# EAGLE schematic headstage_isolation_board_01 (EAGLE 7.5.0)
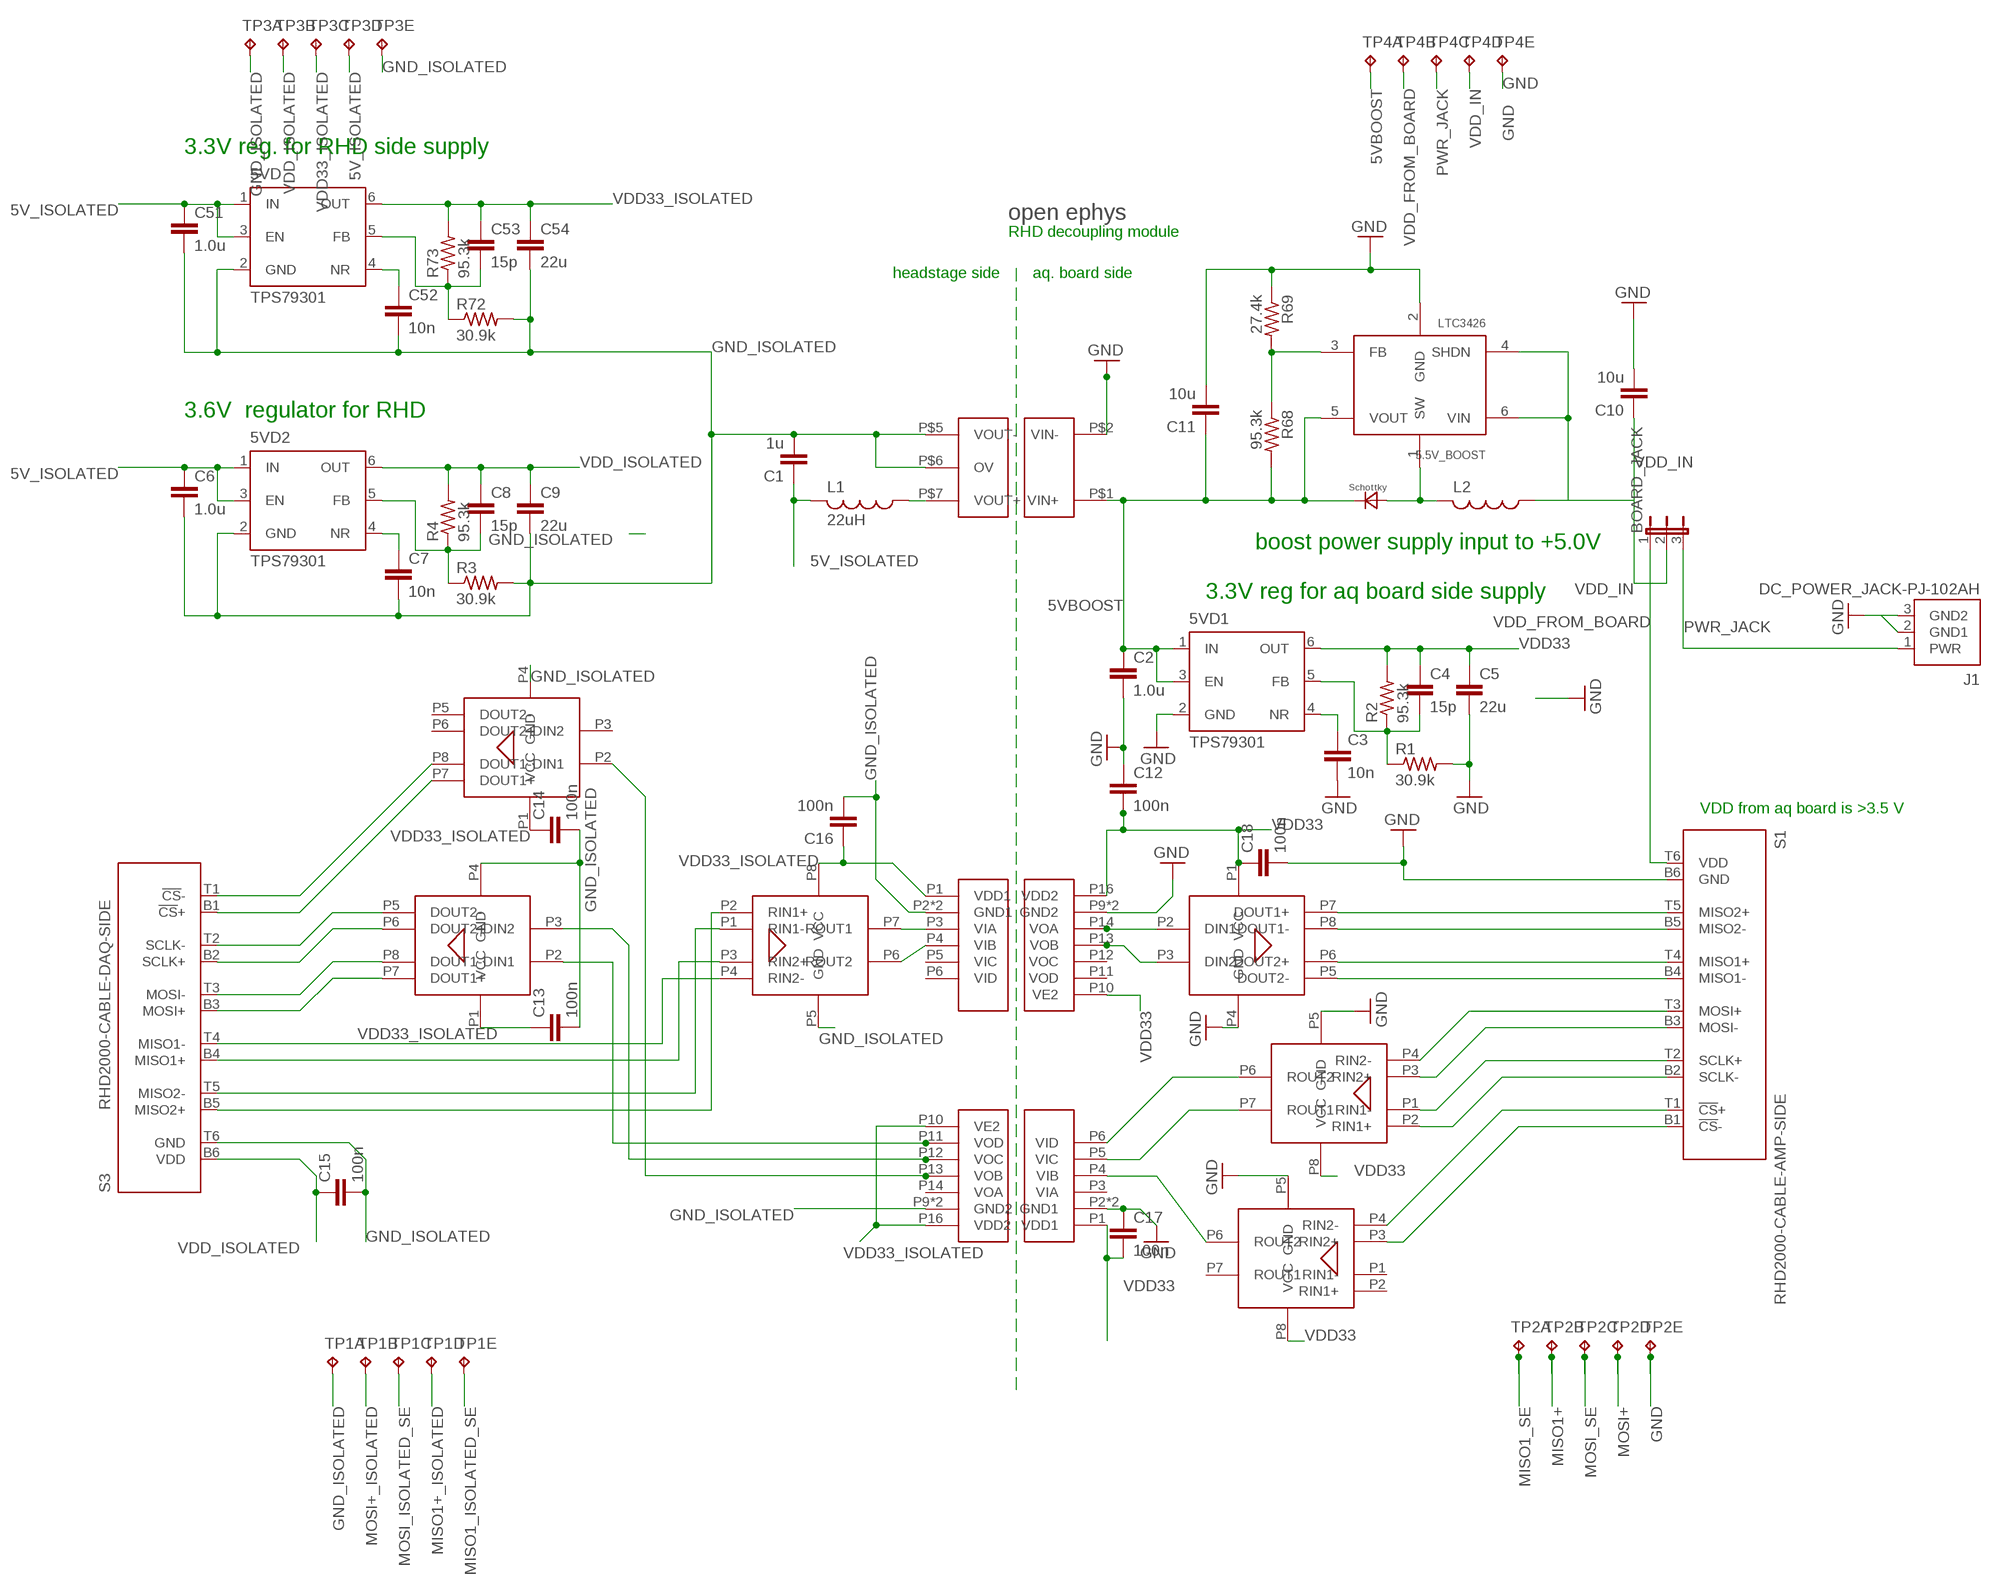
[diagram p0: schematic, sheet 1]

## Parts
5.5V_BOOST  LTC3426  [SOT23-6]
5VD  TPS79301  [SOT-23-6]
5VD1  TPS79301  [SOT-23-6]
5VD2  TPS79301  [SOT-23-6]
BOARD_JACK  JP2E  [JP2]
C1  1u  C_1206  [1206]
C2  1.0u  C_0805  [0805]
C3  10n  C_0603  [0603]
C4  15p  C_0603  [0603]
C5  22u  C_1206  [1206]
C6  1.0u  C_0805  [0805]
C7  10n  C_0603  [0603]
C8  15p  C_0603  [0603]
C9  22u  C_1206  [1206]
C10  10u  C_1206  [1206]
C11  10u  C_1206  [1206]
C12  100n  C_0603  [0603]
C13  100n  C_0603  [0603]
C14  100n  C_0603  [0603]
C15  100n  C_0603  [0603]
C16  100n  C_0603  [0603]
C17  100n  C_0603  [0603]
C18  100n  C_0603  [0603]
C51  1.0u  C_0805  [0805]
C52  10n  C_0603  [0603]
C53  15p  C_0603  [0603]
C54  22u  C_1206  [1206]
D1  MBRA210LT3-D  [MBRA210LT3-D]
J1  DC_POWER_JACK-PJ-102AH  [PJ-102AH]
L1  22uH  L_1206  [1206]
L2  L_1206  [1206]
R1  30.9k  R_0603  [0603]
R2  95.3k  R_0603  [0603]
R3  30.9k  R_0603  [0603]
R4  95.3k  R_0603  [0603]
R68  95.3k  R_0603  [0603]
R69  27.4k  R_0603  [0603]
R72  30.9k  R_0603  [0603]
R73  95.3k  R_0603  [0603]
S1  RHD2000-CABLE-AMP-SIDE  [OMNETICS_PZN-12-AA]
S3  RHD2000-CABLE-DAQ-SIDE  [OMNETICS_PZN-12-AA]
TP1  TP5P5-25-13  [P5-25-13]
TP2  TP5P5-25-13  [P5-25-13]
TP3  TP5P5-25-13  [P5-25-13]
TP4  TP5P5-25-13  [P5-25-13]
U$1  OPEN_EPHYS_LOGO  [OPEN_EPHYS_LOGO]
U$2  ADUM3440  [SOIC_WIDE_16]
U$4  ADN4663  [8-SOIC]
U$5  ADN4663  [8-SOIC]
U$6  ADN4664  [8-SOIC]
U$7  ADN4664  [8-SOIC]
U$8  ADN4664  [8-SOIC]
U$9  ADN4663  [8-SOIC]
U$10  ADUM3440  [SOIC_WIDE_16]
U$12  NMV0505  [NMV0505]

## Nets
5V_ISOLATED: 5VD2.1(IN) 5VD2.3(EN) 5VD.1(IN) 5VD.3(EN) C1.1 C6.1 C51.1 L1.2 TP3.TP-4
5VBOOST: 5.5V_BOOST.5(VOUT) 5VD1.1(IN) 5VD1.3(EN) C2.1 C11.1 D1.NEG R68.2 TP4.TP-1 U$12.P$1(VIN+)
CS+: S1.T1(!CS!+) U$8.P4(RIN2-)
CS+_ISOLATED: S3.B1(!CS!+) U$9.P7(DOUT1+)
CS-: S1.B1(!CS!-) U$8.P3(RIN2+)
CS-_ISOLATED: S3.T1(!CS!-) U$9.P8(DOUT1-)
CS_ISOLATED_SE: U$2.P13(VOB) U$9.P2(DIN1)
CS_SE: U$2.P4(VIB) U$8.P6(ROUT2)
GND: 5.5V_BOOST.2(GND) 5VD1.2(GND) C2.2 C3.2 C5.2 C10.2 C11.2 C12.1 C17.1 C18.2 J1.2(GND1) J1.3(GND2) R1.2 R69.1 S1.B6(GND) TP2.TP-5 TP4.TP-5 U$2.P2(GND1) U$2.P8(GND1) U$4.P4(GND) U$7.P5(GND) U$8.P5(GND) U$10.P9(GND2) U$10.P15(GND2) U$12.P$2(VIN-)
GND4: C15.2
GND_ISOLATED: 5VD2.2(GND) 5VD.2(GND) C1.2 C6.2 C7.2 C9.2 C13.2 C14.2 C16.2 C51.2 C52.2 C54.2 R3.2 R72.2 S3.T6(GND) TP1.TP-1 TP3.TP-1 TP3.TP-5 U$2.P9(GND2) U$2.P15(GND2) U$5.P4(GND) U$6.P5(GND) U$9.P4(GND) U$10.P2(GND1) U$10.P8(GND1) U$12.P$5(VOUT-) U$12.P$6(OV)
MISO1+: S1.T4(MISO1+) TP2.TP-2 U$4.P6(DOUT2+)
MISO1+_ISOLATED: S3.B4(MISO1+) TP1.TP-4 U$6.P3(RIN2+)
MISO1-: S1.B4(MISO1-) U$4.P5(DOUT2-)
MISO1-_ISOLATED: S3.T4(MISO1-) U$6.P4(RIN2-)
MISO1_ISOLATED_SE: TP1.TP-5 U$6.P6(ROUT2) U$10.P4(VIB)
MISO1_SE: TP2.TP-1 U$4.P3(DIN2) U$10.P13(VOB)
MISO2+: S1.T5(MISO2+) U$4.P7(DOUT1+)
MISO2+_ISOLATED: S3.B5(MISO2+) U$6.P2(RIN1+)
MISO2-: S1.B5(MISO2-) U$4.P8(DOUT1-)
MISO2-_ISOLATED: S3.T5(MISO2-) U$6.P1(RIN1-)
MISO2_ISOLATED_SE: U$6.P7(ROUT1) U$10.P3(VIA)
MISO2_SE: U$4.P2(DIN1) U$10.P14(VOA)
MOSI+: S1.T3(MOSI+) TP2.TP-4 U$7.P4(RIN2-)
MOSI+_ISOLATED: S3.B3(MOSI+) TP1.TP-2 U$5.P7(DOUT1+)
MOSI-: S1.B3(MOSI-) U$7.P3(RIN2+)
MOSI-_ISOLATED: S3.T3(MOSI-) U$5.P8(DOUT1-)
MOSI_ISOLATED_SE: TP1.TP-3 U$2.P11(VOD) U$5.P2(DIN1)
MOSI_SE: TP2.TP-3 U$2.P6(VID) U$7.P6(ROUT2)
N$32: L1.1 U$12.P$7(VOUT+)
N$33: 5VD1.4(NR) C3.1
N$35: 5VD1.5(FB) C4.2 R1.1 R2.1
N$36: 5VD2.4(NR) C7.1
N$37: 5VD2.5(FB) C8.2 R3.1 R4.1
N$97: 5VD.4(NR) C52.1
N$108: 5VD.5(FB) C53.2 R72.1 R73.1
N$276: 5.5V_BOOST.3(FB) R68.1 R69.2
N$278: 5.5V_BOOST.1(SW) D1.POS L2.2
PWR_JACK: BOARD_JACK.3 J1.1(PWR) TP4.TP-3
SCLK+: S1.T2(SCLK+) U$7.P1(RIN1-)
SCLK+_ISOLATED: S3.B2(SCLK+) U$5.P6(DOUT2+)
SCLK-: S1.B2(SCLK-) U$7.P2(RIN1+)
SCLK-_ISOLATED: S3.T2(SCLK-) U$5.P5(DOUT2-)
SCLK_ISOLATED_SE: U$2.P12(VOC) U$5.P3(DIN2)
SCLK_SE: U$2.P5(VIC) U$7.P7(ROUT1)
VDD33: 5VD1.6(OUT) C4.1 C5.1 C12.2 C17.2 C18.1 R2.2 U$2.P1(VDD1) U$4.P1(VCC) U$7.P8(VCC) U$8.P8(VCC) U$10.P10(VE2) U$10.P16(VDD2)
VDD33_ISOLATED: 5VD.6(OUT) C13.1 C14.1 C16.1 C53.1 C54.1 R73.2 TP3.TP-3 U$2.P10(VE2) U$2.P16(VDD2) U$5.P1(VCC) U$6.P8(VCC) U$9.P1(VCC) U$10.P1(VDD1)
VDD_FROM_BOARD: BOARD_JACK.1 S1.T6(VDD) TP4.TP-2
VDD_IN: 5.5V_BOOST.4(SHDN) 5.5V_BOOST.6(VIN) BOARD_JACK.2 C10.1 L2.1 TP4.TP-4
VDD_ISOLATED: 5VD2.6(OUT) C8.1 C9.1 C15.1 R4.2 S3.B6(VDD) TP3.TP-2
Unconnected: U$2.P3(VIA) U$2.P14(VOA) U$8.P1(RIN1-) U$8.P2(RIN1+) U$8.P7(ROUT1) U$9.P3(DIN2) U$9.P5(DOUT2-) U$9.P6(DOUT2+) U$10.P5(VIC) U$10.P6(VID) U$10.P11(VOD) U$10.P12(VOC)

## Notes on the sheet
- 3.3V reg. for RHD side supply
- RHD decoupling module
- headstage side | aq. board side
- 3.6V  regulator for RHD
- boost power supply input to +5.0V
- 3.3V reg for aq board side supply
- VDD from aq board is >3.5 V

## Library data of the parts
5.5V_BOOST = open-ephys:LTC3426: Boost converter
5VD 5VD1 5VD2 = RHD2000_eval_board:TPS79301: Texas Instruments TPS79301 adjustable regulator
BOARD_JACK = jumper:JP2E: JUMPER
C1-C18 C51-C54 = RHD2000_eval_board:C: Capacitor
D1 = open-ephys:MBRA210LT3-D: Schottky diode
J1 = RHD2000_eval_board:DC_POWER_JACK: DC Power Jack
L1 L2 = RHD2000_eval_board:L: Inductor
R1-R4 R68 R69 R72 R73 = RHD2000_eval_board:R: Resistor
S1 = RHD2000:RHD2000-CABLE-AMP-SIDE
S3 = RHD2000_eval_board:RHD2000-CABLE-DAQ-SIDE: Omnetics PZN-12-AA RHD2000 socket - DAQ side
TP1-TP4 = testpad:TP5: Test pad
U$1 = open-ephys:OPEN_EPHYS_LOGO: Open Ephys logo
U$2 U$10 = open-ephys_old:ADUM3440
U$4 U$5 U$9 = open-ephys:ADN4663
U$6-U$8 = open-ephys:ADN4664
U$12 = open-ephys:NMV0505

## Net classes
1 power: width 0.381 mm